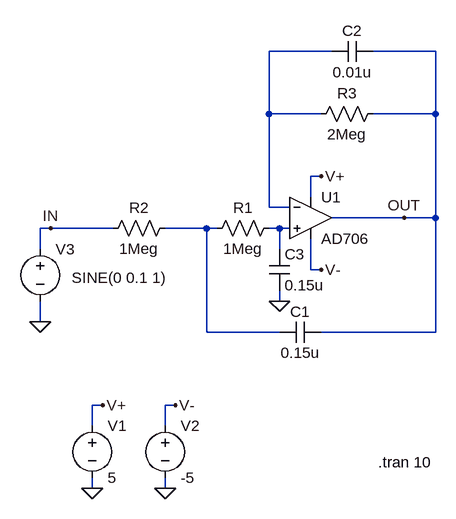
[diagram p0: schematic AD706.asc]
AD706.asc, the LTspice schematic file:
Version 4.1
SHEET 1 880 680
WIRE 400 -208 304 -208
WIRE 560 -208 464 -208
WIRE 304 -112 304 -208
WIRE 384 -112 304 -112
WIRE 560 -112 560 -208
WIRE 560 -112 464 -112
WIRE 384 -16 368 -16
WIRE 368 16 368 -16
WIRE 304 32 304 -112
WIRE 336 32 304 32
WIRE 512 48 400 48
WIRE 560 48 560 -112
WIRE 560 48 512 48
WIRE -32 64 -48 64
WIRE 64 64 -32 64
WIRE 208 64 144 64
WIRE 224 64 208 64
WIRE 320 64 304 64
WIRE 336 64 320 64
WIRE -48 96 -48 64
WIRE 320 96 320 64
WIRE 368 128 368 80
WIRE 384 128 368 128
WIRE 320 176 320 160
WIRE -48 208 -48 176
WIRE 208 224 208 64
WIRE 320 224 208 224
WIRE 560 224 560 48
WIRE 560 224 384 224
WIRE 48 336 32 336
WIRE 160 336 144 336
WIRE 32 368 32 336
WIRE 144 368 144 336
WIRE 32 464 32 448
WIRE 144 464 144 448
FLAG 32 464 0
FLAG 144 464 0
FLAG 48 336 V+
FLAG 160 336 V-
FLAG 384 -16 V+
FLAG 384 128 V-
FLAG 320 176 0
FLAG -48 208 0
FLAG -32 64 IN
FLAG 512 48 OUT
SYMBOL AD706 368 -16 R0
SYMATTR InstName U1
SYMBOL voltage 32 352 R0
SYMATTR InstName V1
SYMATTR Value 5
SYMBOL voltage 144 352 R0
SYMATTR InstName V2
SYMATTR Value -5
SYMBOL cap 384 208 R90
WINDOW 0 0 32 VBottom 2
WINDOW 3 32 32 VTop 2
SYMATTR InstName C1
SYMATTR Value 0.15u
SYMBOL res 320 48 R90
WINDOW 0 0 56 VBottom 2
WINDOW 3 32 56 VTop 2
SYMATTR InstName R1
SYMATTR Value 1Meg
SYMBOL res 160 48 R90
WINDOW 0 0 56 VBottom 2
WINDOW 3 32 56 VTop 2
SYMATTR InstName R2
SYMATTR Value 1Meg
SYMBOL cap 464 -224 R90
WINDOW 0 0 32 VBottom 2
WINDOW 3 32 32 VTop 2
WINDOW 123 79 33 VBottom 2
SYMATTR InstName C2
SYMATTR Value 0.01u
SYMBOL cap 304 96 R0
SYMATTR InstName C3
SYMATTR Value 0.15u
SYMBOL voltage -48 80 R0
WINDOW 3 48 60 Left 2
WINDOW 123 46 79 Left 2
WINDOW 39 0 0 Left 0
SYMATTR Value SINE(0 0.1 1)
SYMATTR InstName V3
SYMBOL res 480 -128 R90
WINDOW 0 0 56 VBottom 2
WINDOW 3 32 56 VTop 2
SYMATTR InstName R3
SYMATTR Value 2Meg
TEXT 472 424 Left 2 !.tran 10

The netlist it stands for:
* AD706.asc
* U1: AD706 (symbol AD706 not available, pins judged from their places): In+=N003 In-=N001 V+=V+ V-=V- OUT=OUT
V1 V+ 0 5
V2 V- 0 -5
C1 OUT N002 0.15u
R1 N003 N002 1Meg
R2 N002 IN 1Meg
C2 OUT N001 0.01u
C3 N003 0 0.15u
V3 IN 0 SINE(0 0.1 1)
R3 OUT N001 2Meg
.tran 10
.backanno
.end